# EAGLE schematic tfmsx (EAGLE 9.6.2)

## Sheet 1 of 2
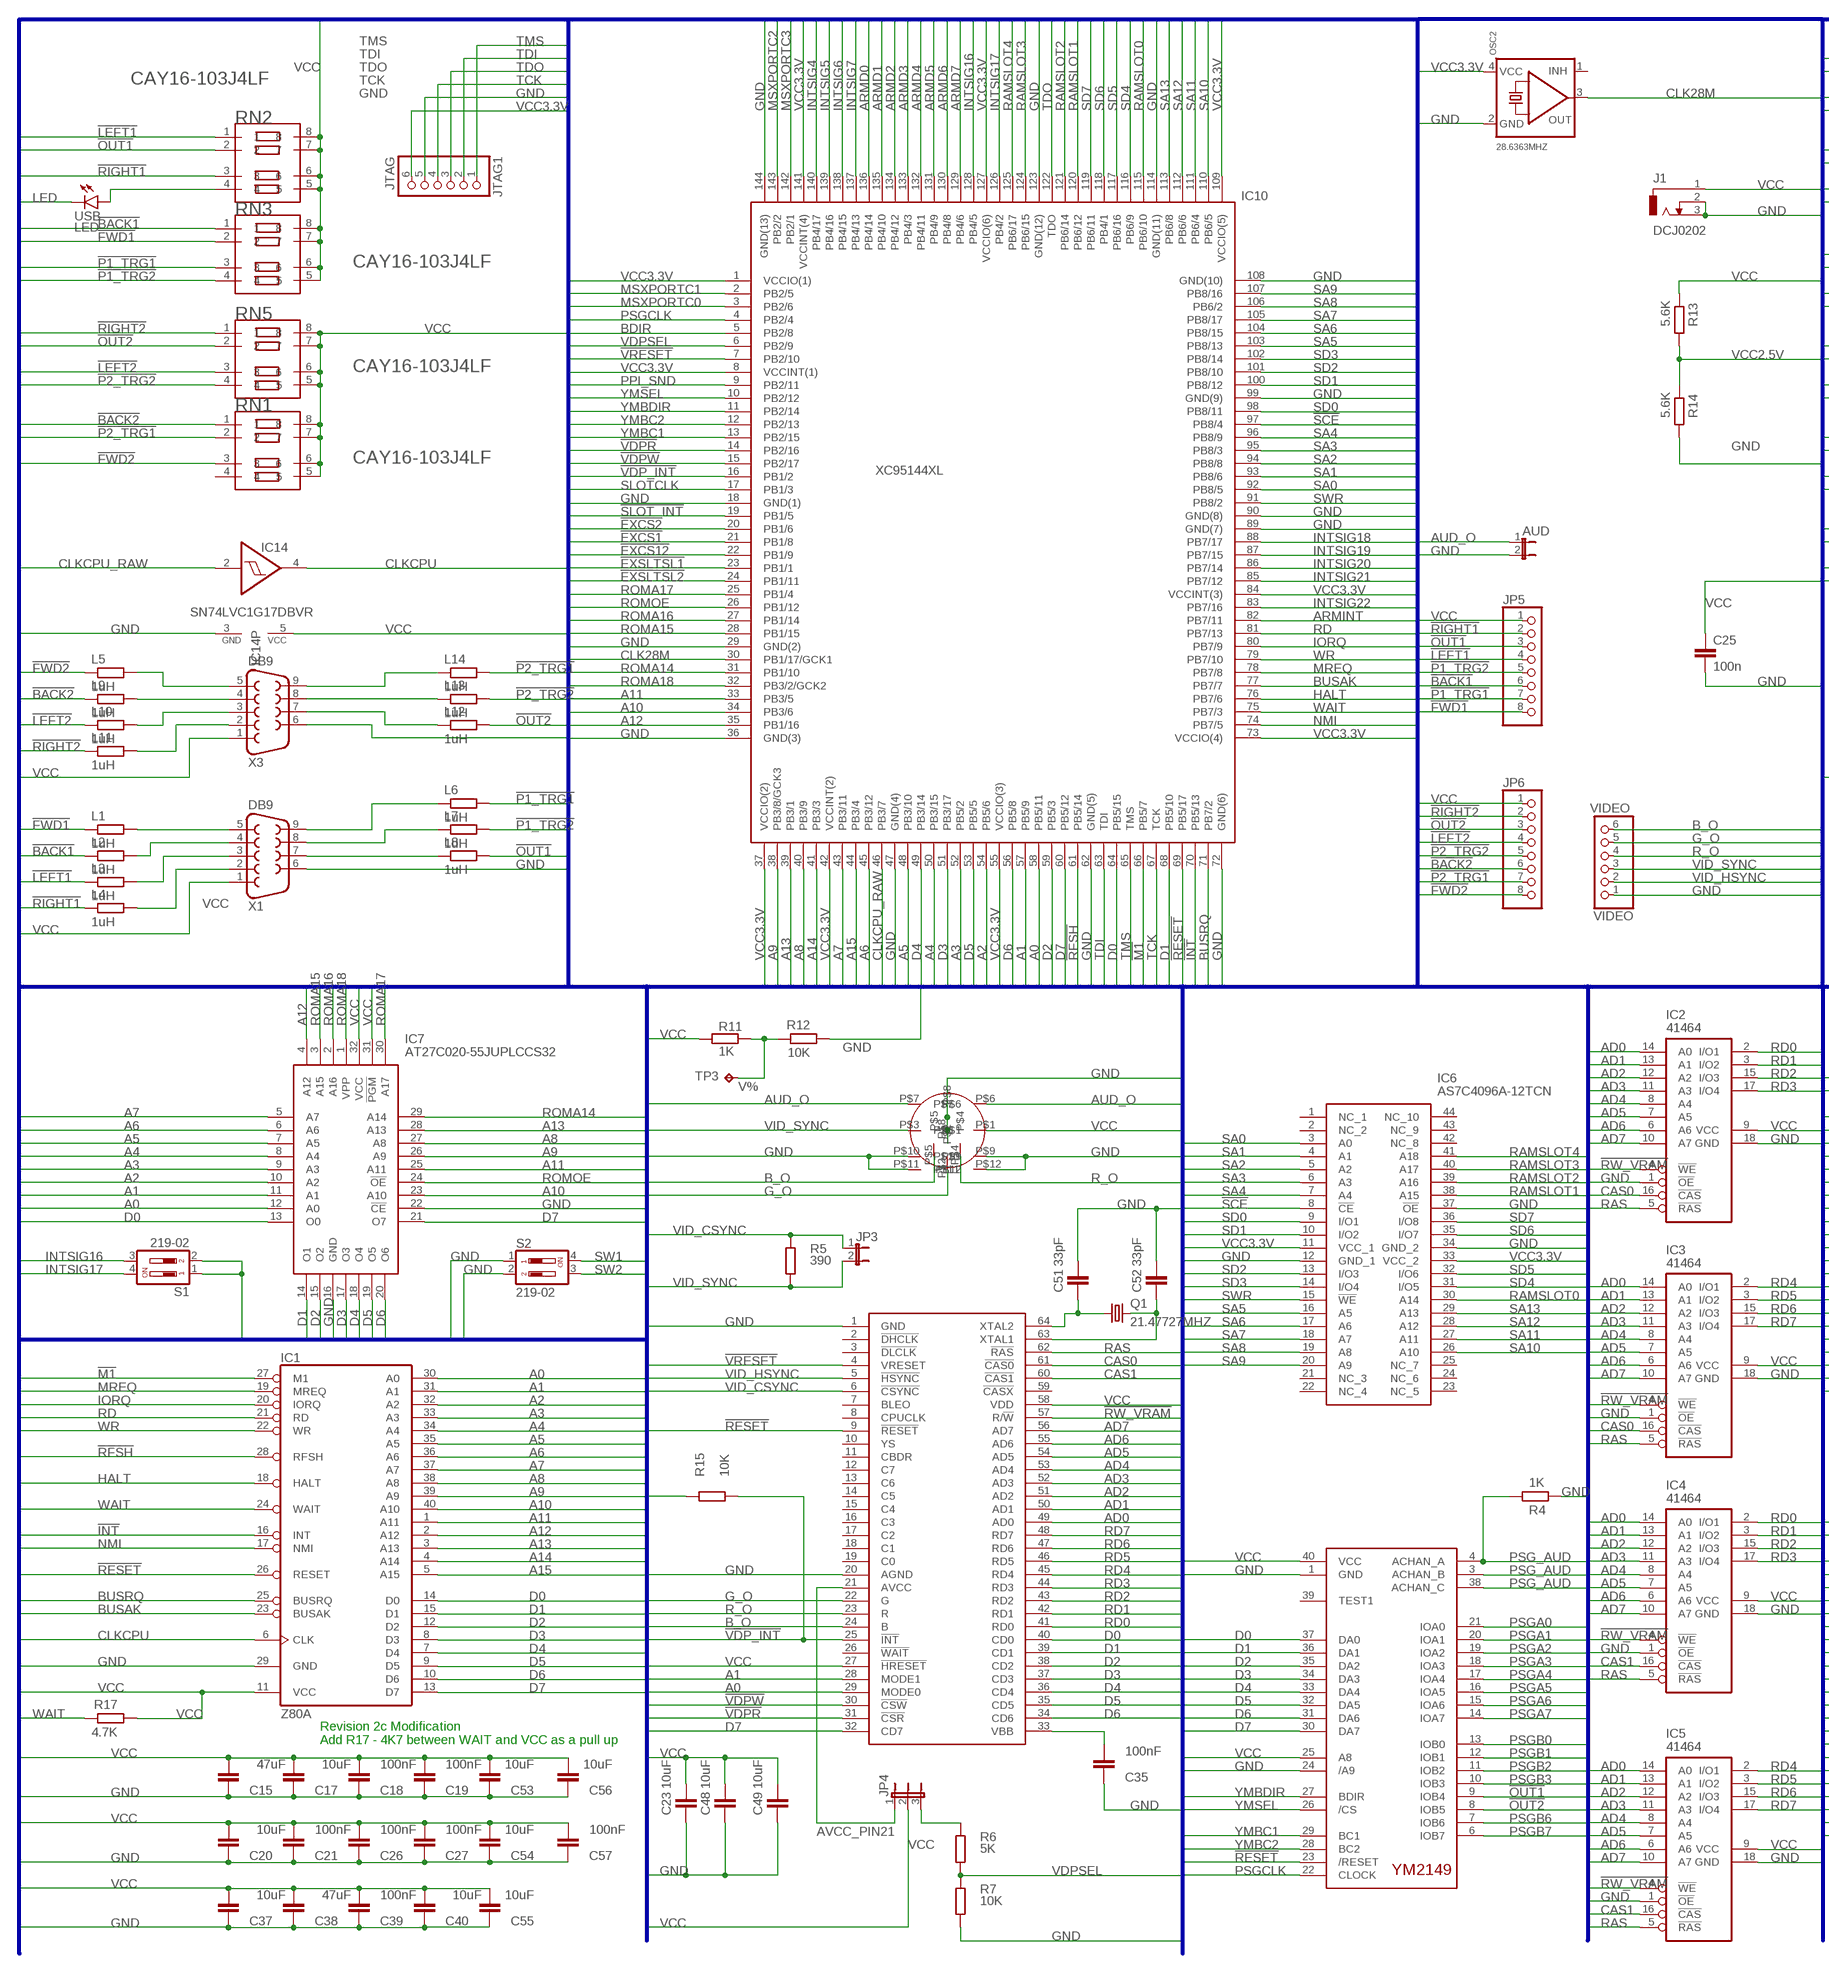
[diagram p0: schematic, sheet 1, part 1 of 2]
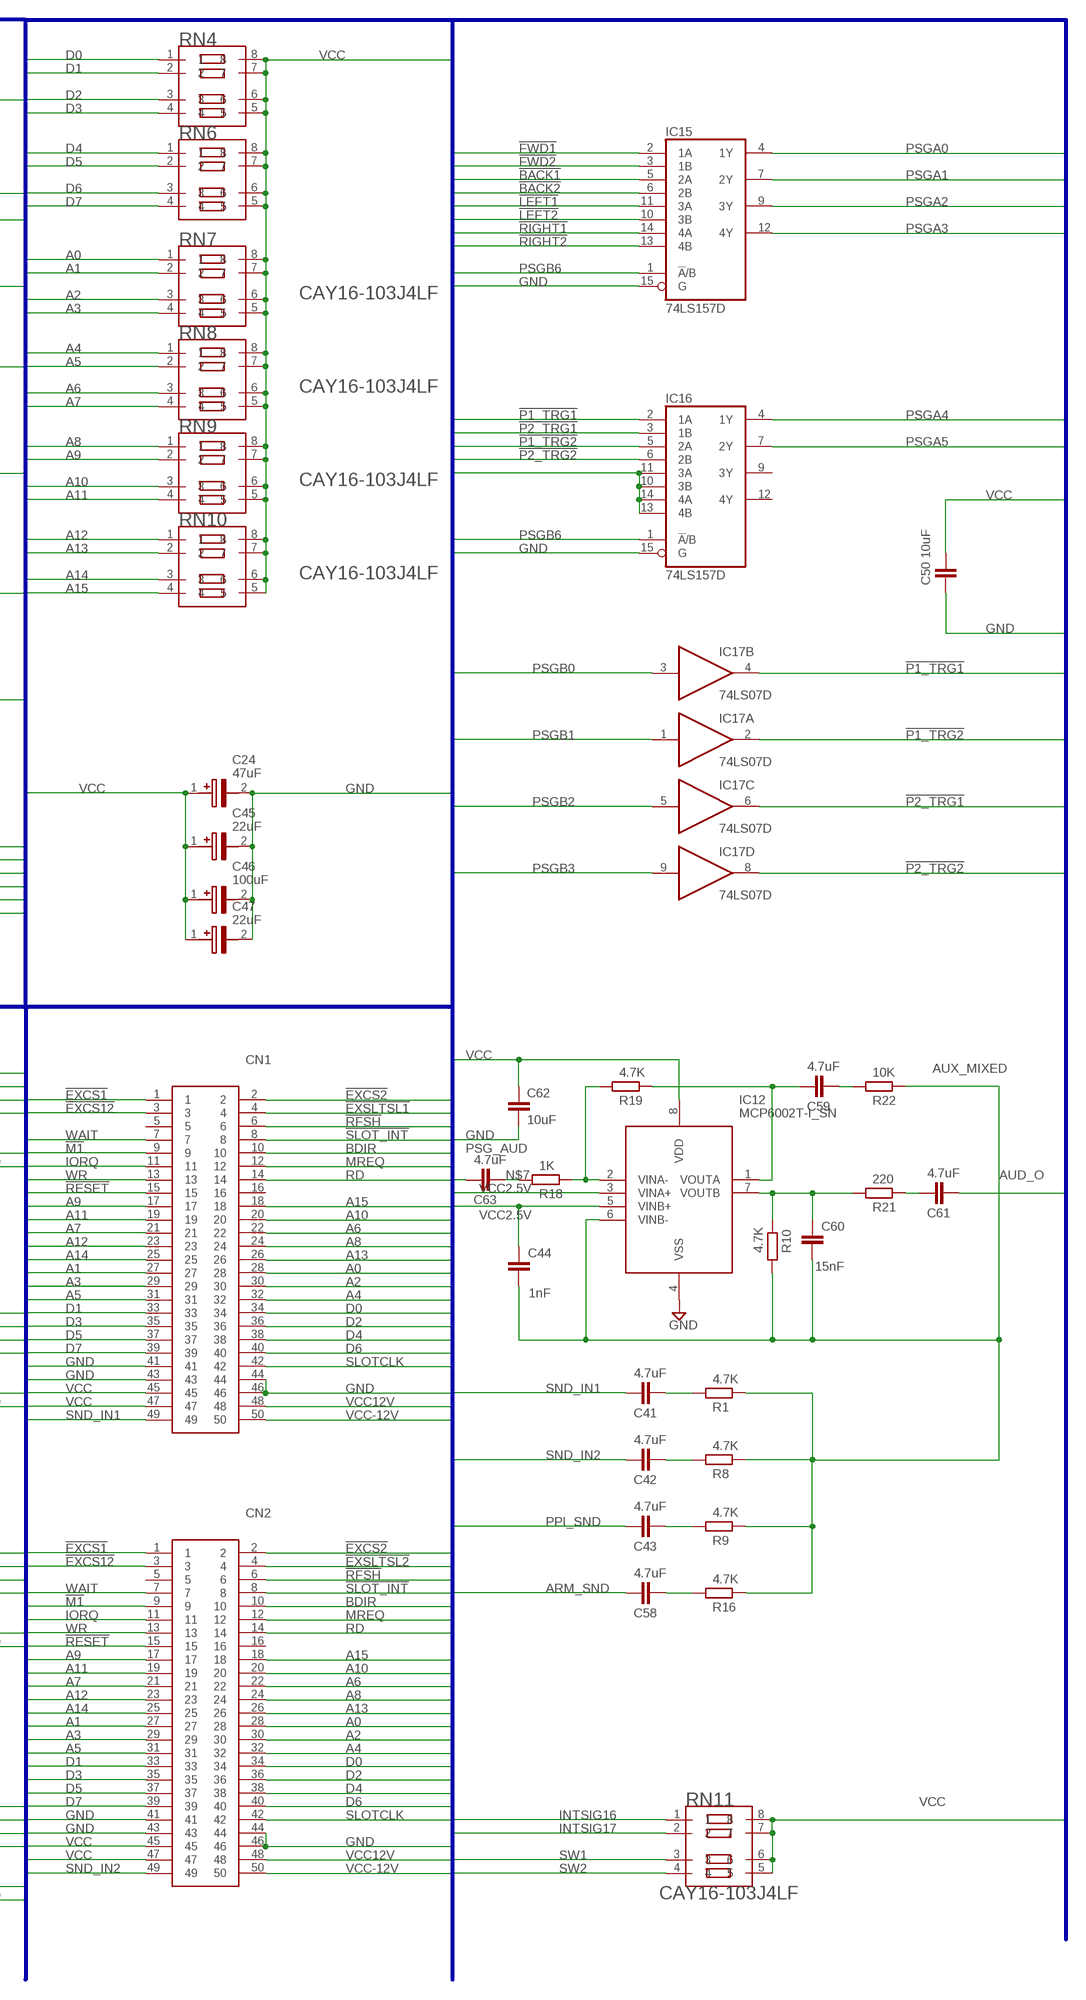
[diagram p1: schematic, sheet 1, part 2 of 2]

### Parts
AUD  JUMPER-2PTH  [1X02]
C15  47uF  C-EUC1206  [C1206]
C17  10uF  C-EUC1206  [C1206]
C18  100nF  C-EUC1206  [C1206]
C19  100nF  C-EUC1206  [C1206]
C20  10uF  C-EUC1206  [C1206]
C21  100nF  C-EUC1206  [C1206]
C23  10uF  C-EUC1206  [C1206]
C24  47uF  EEEHA1C100R  [CAPAE430X550N]
C25  100n  C-EUC0603  [C0603]
C26  100nF  C-EUC1206  [C1206]
C27  100nF  C-EUC1206  [C1206]
C35  100nF  C-EUC1206  [C1206]
C37  10uF  C-EUC1206  [C1206]
C38  47uF  C-EUC1206  [C1206]
C39  100nF  C-EUC1206  [C1206]
C40  10uF  C-EUC1206  [C1206]
C41  4.7uF  C-EUC0603  [C0603]
C42  4.7uF  C-EUC0603  [C0603]
C43  4.7uF  C-EUC0603  [C0603]
C44  1nF  C-EUC0603  [C0603]
C45  22uF  EEEHA1C100R  [CAPAE430X550N]
C46  100uF  EEEHA1C100R  [CAPAE430X550N]
C47  22uF  EEEHA1C100R  [CAPAE430X550N]
C48  10uF  C-EUC1206  [C1206]
C49  10uF  C-EUC1206  [C1206]
C50  10uF  C-EUC1206  [C1206]
C51  33pF  C-EUC0805  [C0805]
C52  33pF  C-EUC0805  [C0805]
C53  10uF  C-EUC1206  [C1206]
C54  10uF  C-EUC1206  [C1206]
C55  10uF  C-EUC1206  [C1206]
C56  10uF  C-EUC1206  [C1206]
C57  100nF  C-EUC1206  [C1206]
C58  4.7uF  C-EUC0603  [C0603]
C59  4.7uF  C-EUC0603  [C0603]
C60  15nF  C-EUC0603  [C0603]
C61  4.7uF  C-EUC0603  [C0603]
C62  10uF  C-EUC1206  [C1206]
C63  4.7uF  C-EUC0603  [C0603]
CN1  5530843-5  [55308435]
CN2  5530843-5  [55308435]
IC1  Z80A  Z80CPU  [DIL40]
IC2  41464  [DIL18]
IC3  41464  [DIL18]
IC4  41464  [DIL18]
IC5  41464  [DIL18]
IC6  AS7C4096A-12TCN  [SOP80P1181X120-44N]
IC7  AT27C020-55JUPLCCS32  [PLCC-S32]
IC9  VDP9958  [SOT274]
IC10  XC95144XL  SAMACSYS_PARTS_XC95144XL-10TQG144I  [SAMACSYS_PARTS_QFP50P2200X2200X160-144N]
IC12  MCP6002T-I_SN  [SOIC127P600X175-8N]
IC13  YM2149  [DIL40]
IC14  SN74LVC1G17DBVR  74LVC1G17DBV  [SOT23-5]
IC15  74LS157D  [SO16]
IC16  74LS157D  [SO16]
IC17  74LS07D  [SO14]
J1  DCJ0202  [DCJ0202]
JP3  JP1E  [JP1]
JP4  JP2E  [JP2]
JP5  HEADER-1X8ROUND  [1X08_ROUND]
JP6  HEADER-1X8ROUND  [1X08_ROUND]
JTAG1  JTAG  HEADER-1X6ROUND  [1X06_ROUND]
L1  1uH  R-EU_R1206  [R1206]
L2  1uH  R-EU_R1206  [R1206]
L3  1uH  R-EU_R1206  [R1206]
L4  1uH  R-EU_R1206  [R1206]
L5  1uH  R-EU_R1206  [R1206]
L6  1uH  R-EU_R1206  [R1206]
L7  1uH  R-EU_R1206  [R1206]
L8  1uH  R-EU_R1206  [R1206]
L9  1uH  R-EU_R1206  [R1206]
L10  1uH  R-EU_R1206  [R1206]
L11  1uH  R-EU_R1206  [R1206]
L12  1uH  R-EU_R1206  [R1206]
L13  1uH  R-EU_R1206  [R1206]
L14  1uH  R-EU_R1206  [R1206]
OSC2  28.6363MHZ  OSCILLATOR  [OSC_7X5MM]
Q1  21.47727MHZ  CRYSTALHC49S  [HC49/S]
R1  4.7K  R-EU_M0805  [M0805]
R4  1K  R-EU_M0805  [M0805]
R5  390  R-EU_M0805  [M0805]
R6  5K  R-EU_M0805  [M0805]
R7  10K  R-EU_M0805  [M0805]
R8  4.7K  R-EU_M0805  [M0805]
R9  4.7K  R-EU_M0805  [M0805]
R10  4.7K  R-EU_M0805  [M0805]
R11  1K  R-EU_M0805  [M0805]
R12  10K  R-EU_M0805  [M0805]
R13  5.6K  R-EU_M0805  [M0805]
R14  5.6K  R-EU_M0805  [M0805]
R15  10K  R-EU_M0805  [M0805]
R16  4.7K  R-EU_M0805  [M0805]
R17  4.7K  R-EU_M0805  [M0805]
R18  1K  R-EU_M0805  [M0805]
R19  4.7K  R-EU_M0805  [M0805]
R21  220  R-EU_M0805  [M0805]
R22  10K  R-EU_M0805  [M0805]
RN1  CAY16-103J4LF  [RESCAXE80P320X160-8N]
RN2  CAY16-103J4LF  [RESCAXE80P320X160-8N]
RN3  CAY16-103J4LF  [RESCAXE80P320X160-8N]
RN4  CAY16-103J4LF  [RESCAXE80P320X160-8N]
RN5  CAY16-103J4LF  [RESCAXE80P320X160-8N]
RN6  CAY16-103J4LF  [RESCAXE80P320X160-8N]
RN7  CAY16-103J4LF  [RESCAXE80P320X160-8N]
RN8  CAY16-103J4LF  [RESCAXE80P320X160-8N]
RN9  CAY16-103J4LF  [RESCAXE80P320X160-8N]
RN10  CAY16-103J4LF  [RESCAXE80P320X160-8N]
RN11  CAY16-103J4LF  [RESCAXE80P320X160-8N]
S1  219-02  [CTS-219-02]
S2  219-02  [CTS-219-02]
TP3  TPB1,27  [B1,27]
U$3  DIN45326  [838_DIN8]
USB  LED  LEDSML0805  [SML0805]
VIDEO  VIDEO  HEADER-1X6ROUND  [1X06_ROUND]
X1  DB9  F09HP  [F09HP]
X3  DB9  F09HP  [F09HP]

### Nets
!BACK1: IC15.5(2A) JP5.6 L2.1 RN3.1 ; also sheet 2
!BACK1_B: L2.2 X1.4
!BACK2: IC15.6(2B) JP6.6 L9.1 RN1.1
!EXCS1: CN1.1 CN2.1 IC10.21(PB1/8)
!EXCS2: CN1.2 CN2.2 IC10.20(PB1/6)
!EXCS12: CN1.3 CN2.3 IC10.22(PB1/9)
!EXSLTSL1: CN1.4 IC10.23(PB1/1)
!EXSLTSL2: CN2.4 IC10.24(PB1/11)
!FWD1: IC15.2(1A) JP5.8 L1.1 RN3.2 ; also sheet 2
!FWD1_B: L1.2 X1.5
!FWD2: IC15.3(1B) JP6.8 L5.1 RN1.3
!INT: IC1.16(INT) IC10.70(PB5/13)
!LEFT1: IC15.11(3A) JP5.4 L3.1 RN2.1 ; also sheet 2
!LEFT1_B: L3.2 X1.3
!LEFT2: IC15.10(3B) JP6.4 L10.1 RN5.3
!M1: CN1.9 CN2.9 IC1.27(M1) IC10.66(PB5/7)
!OUT1: IC13.9(IOB4) JP5.3 L8.2 RN2.2 ; also sheet 2
!OUT2: IC13.8(IOB5) JP6.3 L12.2 RN5.2
!P1_TRG1: IC16.2(1A) IC17.4(B:O) JP5.7 L6.2 RN3.3 ; also sheet 2
!P1_TRG2: IC16.5(2A) IC17.2(A:O) JP5.5 L7.2 RN3.4 ; also sheet 2
!P2_TRG1: IC16.3(1B) IC17.6(C:O) JP6.7 L14.2 RN1.2
!P2_TRG2: IC16.6(2B) IC17.8(D:O) JP6.5 L13.2 RN5.4
!RESET: CN1.15 CN2.15 IC1.26(RESET) IC9.9(!RESET) IC10.69(PB5/17) IC13.23(/RESET)
!RFSH: CN1.6 CN2.6 IC1.28(RFSH) IC10.61(PB5/14)
!RIGHT1: IC15.14(4A) JP5.2 L4.1 RN2.3 ; also sheet 2
!RIGHT1_B: L4.2 X1.2
!RIGHT2: IC15.13(4B) JP6.2 L11.1 RN5.1
!RW_VRAM: IC2.4(!WE) IC3.4(!WE) IC4.4(!WE) IC5.4(!WE) IC9.57(R/!W)
!SCE: IC6.8(!CE) IC10.97(PB8/4)
!SLOT_INT: CN1.8 CN2.8 IC10.19(PB1/5)
!VDP_INT: IC9.25(!INT) IC10.16(PB1/2) R15.1
!VDPR: IC9.31(!CSR) IC10.14(PB2/16)
!VDPW: IC9.30(!CSW) IC10.15(PB2/17)
!VRESET: IC9.4(VRESET) IC10.7(PB2/10)
A0: CN1.28 CN2.28 IC1.30(A0) IC7.12(A0) IC9.29(MODE0) IC10.58(PB5/11) RN7.1
A1: CN1.27 CN2.27 IC1.31(A1) IC7.11(A1) IC9.28(MODE1) IC10.57(PB5/9) RN7.2
A2: CN1.30 CN2.30 IC1.32(A2) IC7.10(A2) IC10.54(PB5/6) RN7.3
A3: CN1.29 CN2.29 IC1.33(A3) IC7.9(A3) IC10.52(PB5/2) RN7.4
A4: CN1.32 CN2.32 IC1.34(A4) IC7.8(A4) IC10.50(PB3/15) RN8.1
A5: CN1.31 CN2.31 IC1.35(A5) IC7.7(A5) IC10.48(PB3/10) RN8.2
A6: CN1.22 CN2.22 IC1.36(A6) IC7.6(A6) IC10.45(PB3/12) RN8.3
A7: CN1.21 CN2.21 IC1.37(A7) IC7.5(A7) IC10.43(PB3/11) RN8.4
A8: CN1.24 CN2.24 IC1.38(A8) IC7.27(A8) IC10.40(PB3/9) RN9.1
A9: CN1.17 CN2.17 IC1.39(A9) IC7.26(A9) IC10.38(PB3/8/GCK3) RN9.2
A10: CN1.20 CN2.20 IC1.40(A10) IC7.23(A10) IC10.34(PB3/6) RN9.3
A11: CN1.19 CN2.19 IC1.1(A11) IC7.25(A11) IC10.33(PB3/5) RN9.4
A12: CN1.23 CN2.23 IC1.2(A12) IC7.4(A12) IC10.35(PB1/16) RN10.1
A13: CN1.26 CN2.26 IC1.3(A13) IC7.28(A13) IC10.39(PB3/1) RN10.2
A14: CN1.25 CN2.25 IC1.4(A14) IC10.41(PB3/3) RN10.3
A15: CN1.18 CN2.18 IC1.5(A15) IC10.44(PB3/4) RN10.4
AD0: IC2.14(A0) IC3.14(A0) IC4.14(A0) IC5.14(A0) IC9.49(AD0)
AD1: IC2.13(A1) IC3.13(A1) IC4.13(A1) IC5.13(A1) IC9.50(AD1)
AD2: IC2.12(A2) IC3.12(A2) IC4.12(A2) IC5.12(A2) IC9.51(AD2)
AD3: IC2.11(A3) IC3.11(A3) IC4.11(A3) IC5.11(A3) IC9.52(AD3)
AD4: IC2.8(A4) IC3.8(A4) IC4.8(A4) IC5.8(A4) IC9.53(AD4)
AD5: IC2.7(A5) IC3.7(A5) IC4.7(A5) IC5.7(A5) IC9.54(AD5)
AD6: IC2.6(A6) IC3.6(A6) IC4.6(A6) IC5.6(A6) IC9.55(AD6)
AD7: IC2.10(A7) IC3.10(A7) IC4.10(A7) IC5.10(A7) IC9.56(AD7)
ARM_SND: C58.1 ; also sheet 2
ARMD0: IC10.136(PB4/14) ; also sheet 2
ARMD1: IC10.135(PB4/10) ; also sheet 2
ARMD2: IC10.134(PB4/12) ; also sheet 2
ARMD3: IC10.133(PB4/3) ; also sheet 2
ARMD4: IC10.132(PB4/11) ; also sheet 2
ARMD5: IC10.131(PB4/9) ; also sheet 2
ARMD6: IC10.130(PB4/8) ; also sheet 2
ARMD7: IC10.129(PB4/6) ; also sheet 2
ARMINT: IC10.82(PB7/11) ; also sheet 2
AUD_O: AUD.1 C61.2 U$3.P$6 U$3.P$7
AUX_MIXED: C44.1 C60.1 IC12.6(VINB-) R1.1 R8.1 R9.1 R10.2 R16.1 R22.1
AVCC_PIN21: IC9.21(AVCC) JP4.1
B_O: IC9.24(B) U$3.P$5 VIDEO.6
BDIR: CN1.10 CN2.10 IC10.5(PB2/8)
BUSAK: IC1.23(BUSAK) IC10.77(PB7/7)
BUSRQ: IC1.25(BUSRQ) IC10.71(PB7/2)
CAS0: IC2.16(!CAS) IC3.16(!CAS) IC9.61(!CAS0)
CAS1: IC4.16(!CAS) IC5.16(!CAS) IC9.60(!CAS1)
CLK28M: IC10.30(PB1/17/GCK1) OSC2.3(OUT)
CLKCPU: IC1.6(CLK) IC14.4(O)
CLKCPU_RAW: IC10.46(PB3/7) IC14.2(I)
D0: CN1.34 CN2.34 IC1.14(D0) IC7.13(O0) IC9.40(CD0) IC10.64(PB5/15) IC13.37(DA0) RN4.1
D1: CN1.33 CN2.33 IC1.15(D1) IC7.14(O1) IC9.39(CD1) IC10.68(PB5/10) IC13.36(DA1) RN4.2
D2: CN1.36 CN2.36 IC1.12(D2) IC7.15(O2) IC9.38(CD2) IC10.59(PB5/3) IC13.35(DA2) RN4.3
D3: CN1.35 CN2.35 IC1.8(D3) IC7.17(O3) IC9.37(CD3) IC10.51(PB3/17) IC13.34(DA3) RN4.4
D4: CN1.38 CN2.38 IC1.7(D4) IC7.18(O4) IC9.36(CD4) IC10.49(PB3/14) IC13.33(DA4) RN6.1
D5: CN1.37 CN2.37 IC1.9(D5) IC7.19(O5) IC9.35(CD5) IC10.53(PB5/5) IC13.32(DA5) RN6.2
D6: CN1.40 CN2.40 IC1.10(D6) IC7.20(O6) IC9.34(CD6) IC10.56(PB5/8) IC13.31(DA6) RN6.3
D7: CN1.39 CN2.39 IC1.13(D7) IC7.21(O7) IC9.32(CD7) IC10.60(PB5/12) IC13.30(DA7) RN6.4
G_O: IC9.22(G) U$3.P$2 VIDEO.5
GND: AUD.2 C15.1 C17.1 C18.1 C19.1 C20.1 C21.1 C23.1 C24.2(-) C25.2 C26.1 C27.1 C35.1 C37.1 C38.1 C39.1 C40.1 C45.2(-) C46.2(-) C47.2(-) C48.1 C49.1 C50.1 C51.2 C52.2 C53.1 C54.1 C55.1 C56.1 C57.1 C62.2 CN1.41 CN1.43 CN1.44 CN1.46 CN2.41 CN2.43 CN2.44 CN2.46 IC1.29(GND) IC2.1(!OE) IC2.18(GND) IC3.1(!OE) IC3.18(GND) IC4.1(!OE) IC4.18(GND) IC5.1(!OE) IC5.18(GND) IC6.12(GND_1) IC6.34(GND_2) IC6.37(!OE) IC7.16(GND) IC7.22(!CE) IC9.1(GND) IC9.20(AGND) IC10.18(GND(1)) IC10.29(GND(2)) IC10.36(GND(3)) IC10.47(GND(4)) IC10.62(GND(5)) IC10.72(GND(6)) IC10.89(GND(7)) IC10.90(GND(8)) IC10.99(GND(9)) IC10.108(GND(10)) IC10.114(GND(11)) IC10.123(GND(12)) IC10.144(GND(13)) IC12.4(VSS) IC13.1(GND) IC13.24(/A9) IC14.3(GND) IC15.15(G) IC16.10(3B) IC16.11(3A) IC16.13(4B) IC16.14(4A) IC16.15(G) J1.2 J1.3 JTAG1.5 OSC2.2(GND) R4.1 R7.1 R12.1 R14.2 S1.1 S1.2 S2.1 S2.2 U$3.P$8 U$3.P$9 U$3.P$10 U$3.P$11 U$3.P$12 VIDEO.1 X1.6 X3.6 ; also sheet 2
HALT: IC1.18(HALT) IC10.76(PB7/6)
INTSIG4: IC10.140(PB4/17) ; also sheet 2
INTSIG5: IC10.139(PB4/16) ; also sheet 2
INTSIG6: IC10.138(PB4/15) ; also sheet 2
INTSIG7: IC10.137(PB4/13) ; also sheet 2
INTSIG16: IC10.128(PB4/5) RN11.1 S1.3 ; also sheet 2
INTSIG17: IC10.126(PB4/2) RN11.2 S1.4 ; also sheet 2
INTSIG18: IC10.88(PB7/17) ; also sheet 2
INTSIG19: IC10.87(PB7/15) ; also sheet 2
INTSIG20: IC10.86(PB7/14) ; also sheet 2
INTSIG21: IC10.85(PB7/12) ; also sheet 2
INTSIG22: IC10.83(PB7/16) ; also sheet 2
IORQ: CN1.11 CN2.11 IC1.20(IORQ) IC10.80(PB7/9)
LED: USB.C ; also sheet 2
MREQ: CN1.12 CN2.12 IC1.19(MREQ) IC10.78(PB7/8)
MSXPORTC0: IC10.3(PB2/6) ; also sheet 2
MSXPORTC1: IC10.2(PB2/5) ; also sheet 2
MSXPORTC2: IC10.143(PB2/2) ; also sheet 2
MSXPORTC3: IC10.142(PB2/1) ; also sheet 2
N$1: C51.1 IC9.64(XTAL2) Q1.1
N$2: C52.1 IC9.63(XTAL1) Q1.2
N$3: C35.2 IC9.33(VBB)
N$4: L8.1 X1.7
N$5: L7.1 X1.8
N$6: L6.1 X1.9
N$7: C63.2 R18.2
N$11: L9.2 X3.4
N$12: L10.2 X3.3
N$13: L11.2 X3.2
N$14: L5.2 X3.5
N$15: L12.1 X3.7
N$16: L13.1 X3.8
N$17: L14.1 X3.9
N$19: RN2.4 USB.A
N$22: C41.2 R1.2
N$23: C42.2 R8.2
N$24: C43.2 R9.2
N$25: C58.2 R16.2
N$27: JP4.3 R6.2
N$31: IC12.2(VINA-) R18.1 R19.2
N$32: C59.1 IC12.1(VOUTA) R19.1
N$34: C59.2 R22.2
N$36: C60.2 IC12.7(VOUTB) R10.1 R21.2
N$37: C61.1 R21.1
NMI: IC1.17(NMI) IC10.74(PB7/5)
PPI_SND: C43.1 IC10.9(PB2/11)
PSG_AUD: C63.1 IC13.3(ACHAN_B) IC13.4(ACHAN_A) IC13.38(ACHAN_C) R4.2
PSGA0: IC13.21(IOA0) IC15.4(1Y)
PSGA1: IC13.20(IOA1) IC15.7(2Y)
PSGA2: IC13.19(IOA2) IC15.9(3Y)
PSGA3: IC13.18(IOA3) IC15.12(4Y)
PSGA4: IC13.17(IOA4) IC16.4(1Y)
PSGA5: IC13.16(IOA5) IC16.7(2Y)
PSGA6: IC13.15(IOA6)
PSGA7: IC13.14(IOA7)
PSGB0: IC13.13(IOB0) IC17.3(B:I)
PSGB1: IC13.12(IOB1) IC17.1(A:I)
PSGB2: IC13.11(IOB2) IC17.5(C:I)
PSGB3: IC13.10(IOB3) IC17.9(D:I)
PSGB6: IC13.7(IOB6) IC15.1(!A!/B) IC16.1(!A!/B)
PSGB7: IC13.6(IOB7)
PSGCLK: IC10.4(PB2/4) IC13.22(CLOCK)
R_O: IC9.23(R) U$3.P$4 VIDEO.4
RAMSLOT0: IC6.30(A14) IC10.115(PB6/10)
RAMSLOT1: IC6.38(A15) IC10.120(PB6/12)
RAMSLOT2: IC6.39(A16) IC10.121(PB6/14)
RAMSLOT3: IC6.40(A17) IC10.124(PB6/15)
RAMSLOT4: IC6.41(A18) IC10.125(PB6/17)
RAS: IC2.5(!RAS) IC3.5(!RAS) IC4.5(!RAS) IC5.5(!RAS) IC9.62(!RAS)
RD: CN1.14 CN2.14 IC1.21(RD) IC10.81(PB7/13)
RD0: IC2.2(I/O1) IC4.2(I/O1) IC9.41(RD0)
RD1: IC2.3(I/O2) IC4.3(I/O2) IC9.42(RD1)
RD2: IC2.15(I/O3) IC4.15(I/O3) IC9.43(RD2)
RD3: IC2.17(I/O4) IC4.17(I/O4) IC9.44(RD3)
RD4: IC3.2(I/O1) IC5.2(I/O1) IC9.45(RD4)
RD5: IC3.3(I/O2) IC5.3(I/O2) IC9.46(RD5)
RD6: IC3.15(I/O3) IC5.15(I/O3) IC9.47(RD6)
RD7: IC3.17(I/O4) IC5.17(I/O4) IC9.48(RD7)
ROMA14: IC7.29(A14) IC10.31(PB1/10)
ROMA15: IC7.3(A15) IC10.28(PB1/15)
ROMA16: IC7.2(A16) IC10.27(PB1/14)
ROMA17: IC7.30(A17) IC10.25(PB1/4)
ROMA18: IC7.1(VPP) IC10.32(PB3/2/GCK2)
ROMOE: IC7.24(!OE) IC10.26(PB1/12)
SA0: IC6.3(A0) IC10.92(PB8/5)
SA1: IC6.4(A1) IC10.93(PB8/6)
SA2: IC6.5(A2) IC10.94(PB8/8)
SA3: IC6.6(A3) IC10.95(PB8/3)
SA4: IC6.7(A4) IC10.96(PB8/9)
SA5: IC6.16(A5) IC10.103(PB8/13)
SA6: IC6.17(A6) IC10.104(PB8/15)
SA7: IC6.18(A7) IC10.105(PB8/17)
SA8: IC6.19(A8) IC10.106(PB6/2)
SA9: IC6.20(A9) IC10.107(PB8/16)
SA10: IC6.26(A10) IC10.110(PB6/5)
SA11: IC6.27(A11) IC10.111(PB6/4)
SA12: IC6.28(A12) IC10.112(PB6/6)
SA13: IC6.29(A13) IC10.113(PB6/8)
SD0: IC6.9(I/O1) IC10.98(PB8/11)
SD1: IC6.10(I/O2) IC10.100(PB8/12)
SD2: IC6.13(I/O3) IC10.101(PB8/10)
SD3: IC6.14(I/O4) IC10.102(PB8/14)
SD4: IC6.31(I/O5) IC10.116(PB6/9)
SD5: IC6.32(I/O6) IC10.117(PB6/16)
SD6: IC6.35(I/O7) IC10.118(PB4/1)
SD7: IC6.36(I/O8) IC10.119(PB6/11)
SLOTCLK: CN1.42 CN2.42 IC10.17(PB1/3)
SND_IN1: C41.1 CN1.49
SND_IN2: C42.1 CN2.49
SW1: RN11.3 S2.4 ; also sheet 2
SW2: RN11.4 S2.3 ; also sheet 2
SWR: IC6.15(!WE) IC10.91(PB8/2)
TCK: IC10.67(TCK) JTAG1.4
TDI: IC10.63(TDI) JTAG1.2
TDO: IC10.122(TDO) JTAG1.3
TMS: IC10.65(TMS) JTAG1.1
V%: R11.1 R12.2 TP3.TP
VCC: C15.2 C17.2 C18.2 C19.2 C20.2 C21.2 C23.2 C24.1(+) C25.1 C26.2 C27.2 C37.2 C38.2 C39.2 C40.2 C45.1(+) C46.1(+) C47.1(+) C48.2 C49.2 C50.2 C53.2 C54.2 C55.2 C56.2 C57.2 C62.1 CN1.45 CN1.47 CN2.45 CN2.47 IC1.11(VCC) IC2.9(VCC) IC3.9(VCC) IC4.9(VCC) IC5.9(VCC) IC7.31(!PGM) IC7.32(VCC) IC9.27(!HRESET) IC9.58(VDD) IC12.8(VDD) IC13.25(A8) IC13.40(VCC) IC14.5(VCC) J1.1 JP4.2 JP5.1 JP6.1 R11.2 R13.1 R15.2 R17.2 RN1.5 RN1.6 RN1.7 RN1.8 RN2.5 RN2.6 RN2.7 RN2.8 RN3.5 RN3.6 RN3.7 RN3.8 RN4.5 RN4.6 RN4.7 RN4.8 RN5.5 RN5.6 RN5.7 RN5.8 RN6.5 RN6.6 RN6.7 RN6.8 RN7.5 RN7.6 RN7.7 RN7.8 RN8.5 RN8.6 RN8.7 RN8.8 RN9.5 RN9.6 RN9.7 RN9.8 RN10.5 RN10.6 RN10.7 RN10.8 RN11.5 RN11.6 RN11.7 RN11.8 U$3.P$1 X1.1 X3.1 ; also sheet 2
VCC2.5V: C44.2 IC12.3(VINA+) IC12.5(VINB+) R13.2 R14.1
VCC3.3V: IC6.11(VCC_1) IC6.33(VCC_2) IC10.1(VCCIO(1)) IC10.8(VCCINT(1)) IC10.37(VCCIO(2)) IC10.42(VCCINT(2)) IC10.55(VCCIO(3)) IC10.73(VCCIO(4)) IC10.84(VCCINT(3)) IC10.109(VCCIO(5)) IC10.127(VCCIO(6)) IC10.141(VCCINT(4)) JTAG1.6 OSC2.4(VCC) ; also sheet 2
VCC12V: CN1.48 CN2.48
VCC-12V: CN1.50 CN2.50
VDPSEL: IC10.6(PB2/9) R6.1 R7.2
VID_CSYNC: IC9.6(!CSYNC) JP3.1 R5.2
VID_HSYNC: IC9.5(!HSYNC) VIDEO.2
VID_SYNC: JP3.2 R5.1 U$3.P$3 VIDEO.3
WAIT: CN1.7 CN2.7 IC1.24(WAIT) IC10.75(PB7/3) R17.1
WR: CN1.13 CN2.13 IC1.22(WR) IC10.79(PB7/10)
YMBC1: IC10.13(PB2/15) IC13.29(BC1)
YMBC2: IC10.12(PB2/13) IC13.28(BC2)
YMBDIR: IC10.11(PB2/14) IC13.27(BDIR)
YMSEL: IC10.10(PB2/12) IC13.26(/CS)
Unconnected: CN1.5 CN1.16 CN2.5 CN2.16 IC6.1(NC_1) IC6.2(NC_2) IC6.21(NC_3) IC6.22(NC_4) IC6.23(NC_5) IC6.24(NC_6) IC6.25(NC_7) IC6.42(NC_8) IC6.43(NC_9) IC6.44(NC_10) IC9.2(!DHCLK) IC9.3(!DLCLK) IC9.7(BLEO) IC9.8(CPUCLK) IC9.10(YS) IC9.11(CBDR) IC9.12(C7) IC9.13(C6) IC9.14(C5) IC9.15(C4) IC9.16(C3) IC9.17(C2) IC9.18(C1) IC9.19(C0) IC9.26(!WAIT) IC9.59(!CASX) IC13.39(TEST1) IC16.9(3Y) IC16.12(4Y) IC17.10(E:O) IC17.11(E:I) IC17.12(F:O) IC17.13(F:I) OSC2.1(INH) RN1.4

### Buses
A[0..15],AD[0..7],ARMD[0..7],ARM_D[0..7],ARMINT,ARM_SND,AUD_O,!BACK[1..2],BDIR,B_O,BUSAK,BUSRQ,CAS[0..3],CD[0..7],CLK28M,CLKCPU,CLKCPU_CLEAN,CLKCPU_RAW,D[0..7],!EXCS[1..2],!EXCS12,!EXSLTSL[1..2],!FWD[1..2],GND,G_O,HALT,!INT,INTSIG[0..23],IORQ,LED,!LEFT[1..2],!M1,MREQ,MSXPORTB[0..7],MSXPORTC[0..7],NMI,O_AUD,!OUT[1..2],!P1_TRG[1..2],!P2_TRG[1..2],PPI_SND,PSGA[0..7],PSG_AUD,PSGB[0..7],PSG_CHAN[1..3],PSGCLK,RAMSLOT[0..4],RAS,RD,RD[0..7],!RESET,!RFSH,!RIGHT[1..2],R_O,ROMA[14..18],ROMCE,ROMOE,!RW_VRAM,SA[0..13],SCC_AUD,!SCE,SD[0..7],SLOTCLK,!SLOT_INT,SND_IN[1..2],SOUND_IN,SW[1..2],SWR,TCK,TDI,TDO,TMS,VCC,VCC2.5V,VCC3.3V,VCC-12V,VCC12V,!VDP_INT,!VDPR,VDPSEL,!VDPW,VID_CSYNC,VID_GND,VID_HSYNC,VID_SYNC,!VRESET,WAIT,WR,YMA8,!YMA9,YMBC[1..2],YMBDIR,YMSEL

### Notes on the sheet
- Revision 2c Modification 
  Add R17 - 4K7 between WAIT and VCC as a pull up

## Sheet 2 of 2
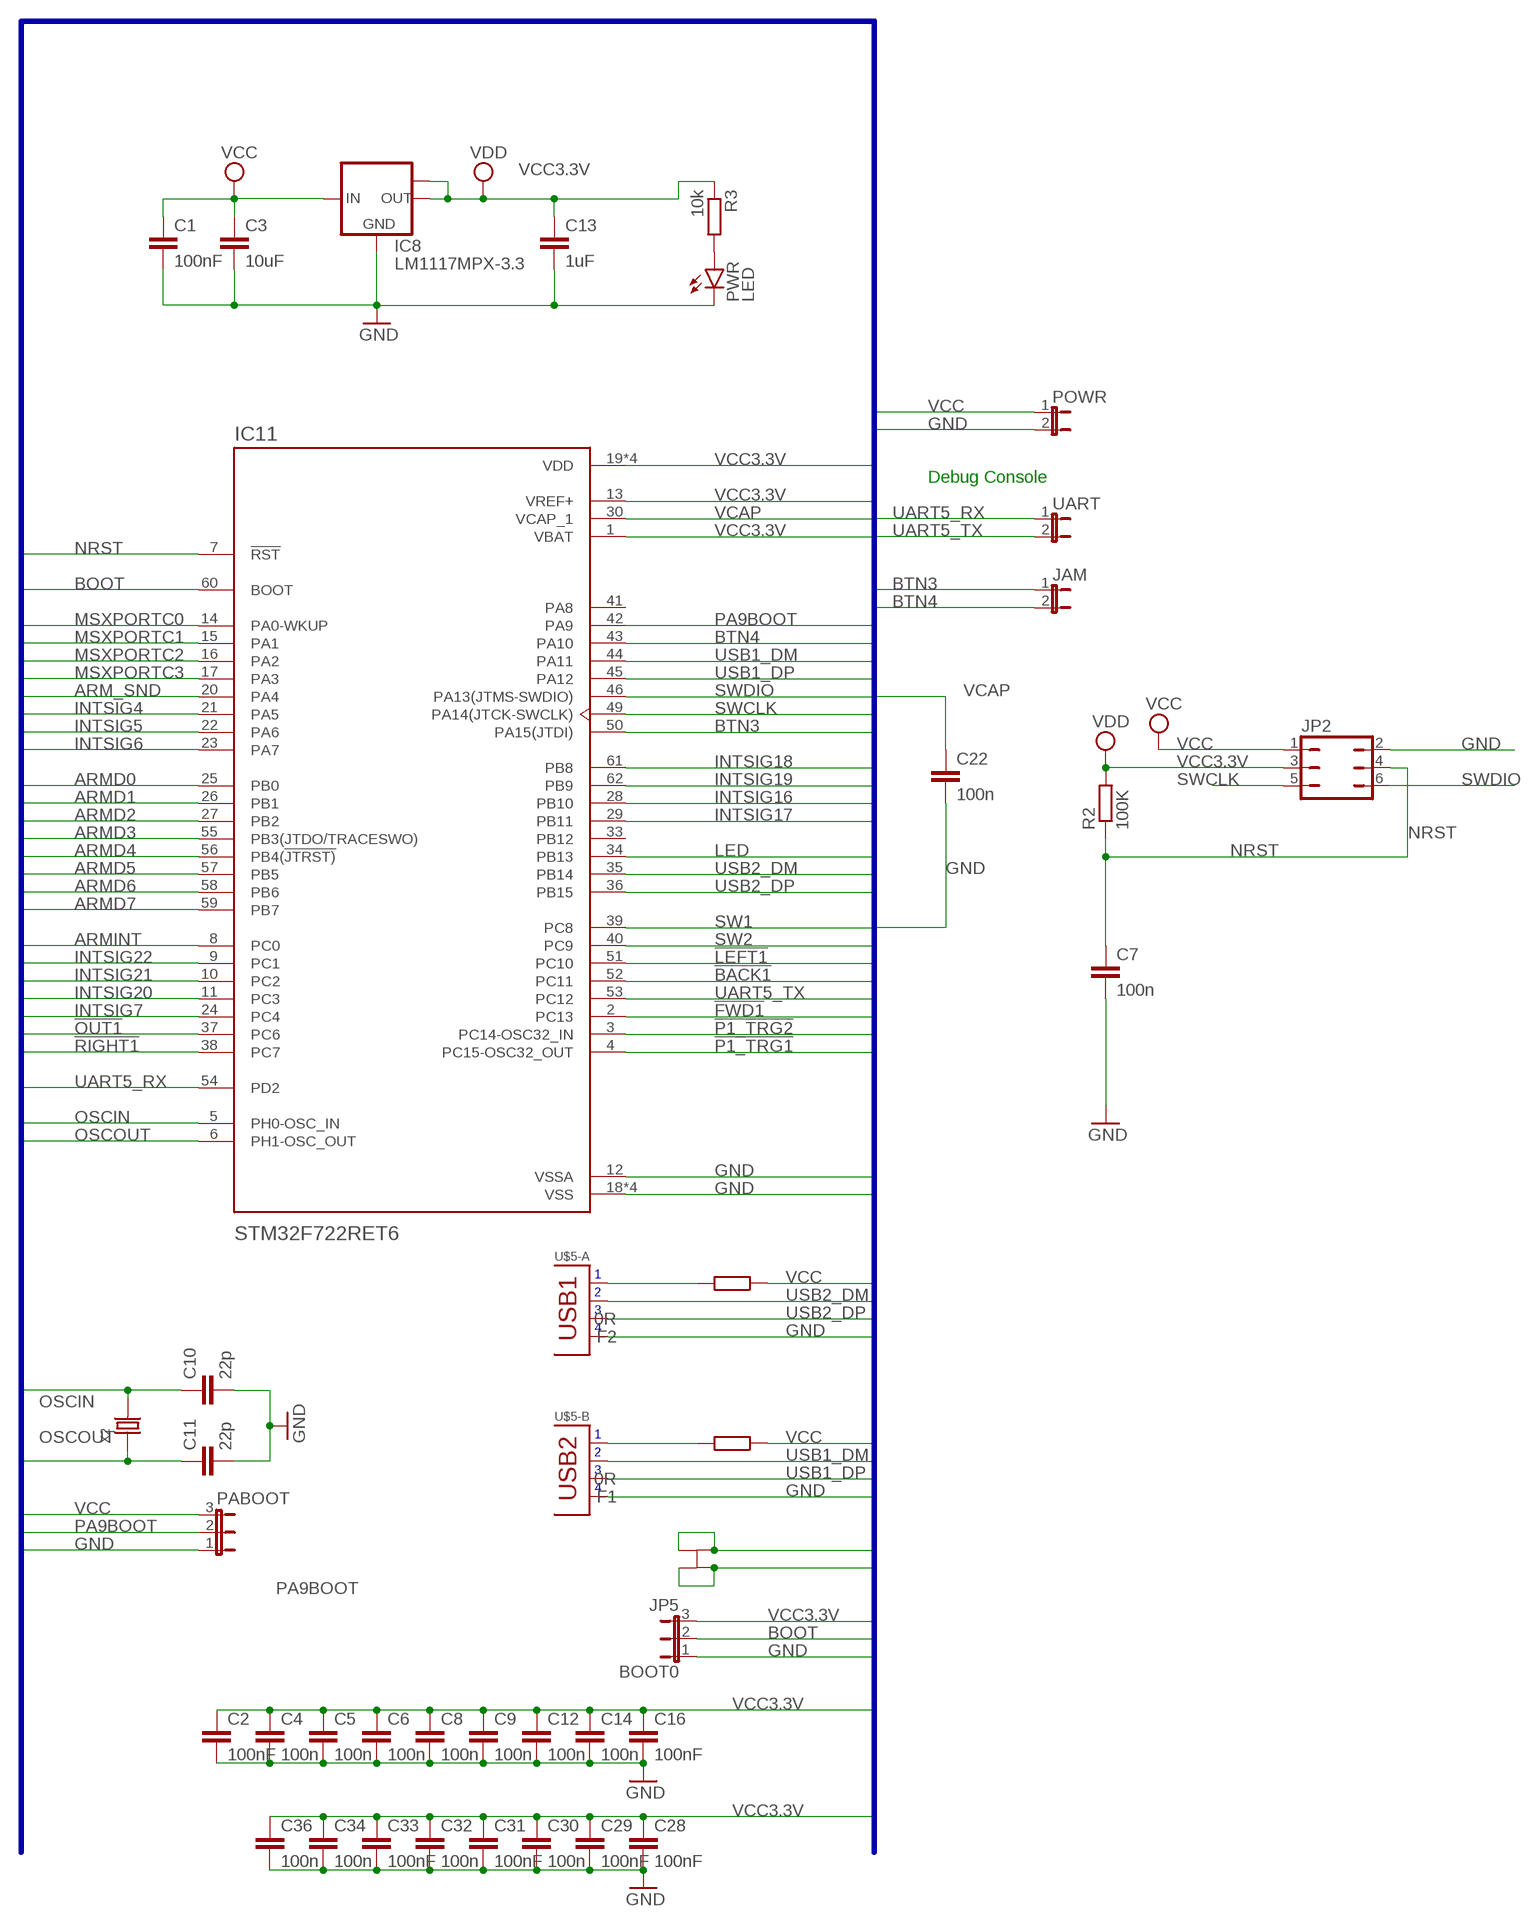
[diagram p2: schematic, sheet 2]

### Parts
BOOT0  JP5  JP2E  [JP2]
C1  100nF  C-EUC1206  [C1206]
C2  100nF  CC0603  [C0603]
C3  10uF  CC0603  [C0603]
C4  100n  CC0603  [C0603]
C5  100n  CC0603  [C0603]
C6  100n  C-EUC0603  [C0603]
C7  100n  CC0603  [C0603]
C8  100n  CC0603  [C0603]
C9  100n  CC0603  [C0603]
C10  22p  CC0603  [C0603]
C11  22p  CC0603  [C0603]
C12  100n  C-EUC0603  [C0603]
C13  1uF  C-EUC1206  [C1206]
C14  100n  CC0603  [C0603]
C16  100nF  CC0603  [C0603]
C22  100n  C-EUC0805  [C0805]
C28  100nF  CC0603  [C0603]
C29  100nF  CC0603  [C0603]
C30  100n  C-EUC0603  [C0603]
C31  100nF  CC0603  [C0603]
C32  100n  CC0603  [C0603]
C33  100nF  C-EUC0603  [C0603]
C34  100n  C-EUC0603  [C0603]
C36  100n  CC0603  [C0603]
F1  0R  RR1206  [R1206]
F2  0R  RR1206  [R1206]
IC8  LM1117MPX-3.3  [SOT223]
IC11  STM32F722RET6  [QFP50P1200X1200X160-64N]
JAM  JUMPER-2PTH  [1X02]
JP2  JP3Q  [JP3Q]
PA9BOOT  PABOOT  JP2E  [JP2]
POWR  JUMPER-2PTH  [1X02]
PWR  LED  LEDSML0805  [SML0805]
R2  100K  R-EU_M0805  [M0805]
R3  10k  R-EU_R0603  [R0603]
U$5  USB-A-2_USB_USB-A-2  [USB-A-2_USB_USB-A-2]
UART  JUMPER-2PTH  [1X02]
X2  SMD-CRYSTAL-25MHZ-20PF-20PPM(2P-5.0X3.2MM)  SMD-CRYSTAL-8MHZ-20PF-20PPM(2P-5.0X3.2MM)  [X2-SMD-5.0X3.2X1.3MM]

### Nets
!BACK1: IC11.52(PC11) ; also sheet 1
!FWD1: IC11.2(PC13) ; also sheet 1
!LEFT1: IC11.51(PC10) ; also sheet 1
!OUT1: IC11.37(PC6) ; also sheet 1
!P1_TRG1: IC11.4(PC15-OSC32_OUT) ; also sheet 1
!P1_TRG2: IC11.3(PC14-OSC32_IN) ; also sheet 1
!RIGHT1: IC11.38(PC7) ; also sheet 1
ARM_SND: IC11.20(PA4) ; also sheet 1
ARMD0: IC11.25(PB0) ; also sheet 1
ARMD1: IC11.26(PB1) ; also sheet 1
ARMD2: IC11.27(PB2) ; also sheet 1
ARMD3: IC11.55(PB3(JTDO/TRACESWO)) ; also sheet 1
ARMD4: IC11.56(PB4(!JTRST)) ; also sheet 1
ARMD5: IC11.57(PB5) ; also sheet 1
ARMD6: IC11.58(PB6) ; also sheet 1
ARMD7: IC11.59(PB7) ; also sheet 1
ARMINT: IC11.8(PC0) ; also sheet 1
BOOT: BOOT0.2 IC11.60(BOOT)
BTN3: IC11.50(PA15(JTDI)) JAM.1
BTN4: IC11.43(PA10) JAM.2
GND: BOOT0.1 C1.2 C2.2 C3.2 C4.2 C5.2 C6.2 C7.2 C8.2 C9.2 C10.2 C11.2 C12.2 C13.2 C14.2 C16.2 C22.2 C28.2 C29.2 C30.2 C31.2 C32.2 C33.2 C34.2 C36.2 IC8.1(GND) IC11.12(VSSA) IC11.18(VSS) IC11.31(VSS) IC11.47(VSS) IC11.63(VSS) JP2.2 PA9BOOT.1 POWR.2 PWR.C U$5.1-4(-A:1-4) U$5.2-4(-B:2-4) U$5.SHIELD1(SHIELD:SHIELD1) U$5.SHIELD2(SHIELD:SHIELD2) U$5.SHIELD3(SHIELD:SHIELD3) U$5.SHIELD4(SHIELD:SHIELD4) ; also sheet 1
INTSIG4: IC11.21(PA5) ; also sheet 1
INTSIG5: IC11.22(PA6) ; also sheet 1
INTSIG6: IC11.23(PA7) ; also sheet 1
INTSIG7: IC11.24(PC4) ; also sheet 1
INTSIG16: IC11.28(PB10) ; also sheet 1
INTSIG17: IC11.29(PB11) ; also sheet 1
INTSIG18: IC11.61(PB8) ; also sheet 1
INTSIG19: IC11.62(PB9) ; also sheet 1
INTSIG20: IC11.11(PC3) ; also sheet 1
INTSIG21: IC11.10(PC2) ; also sheet 1
INTSIG22: IC11.9(PC1) ; also sheet 1
LED: IC11.34(PB13) ; also sheet 1
MSXPORTC0: IC11.14(PA0-WKUP) ; also sheet 1
MSXPORTC1: IC11.15(PA1) ; also sheet 1
MSXPORTC2: IC11.16(PA2) ; also sheet 1
MSXPORTC3: IC11.17(PA3) ; also sheet 1
N$18: PWR.A R3.2
N$20: F1.2 U$5.2-1(-B:2-1)
N$21: F2.2 U$5.1-1(-A:1-1)
NRST: C7.1 IC11.7(!RST) JP2.4 R2.1
OSCIN: C10.1 IC11.5(PH0-OSC_IN) X2.2
OSCOUT: C11.1 IC11.6(PH1-OSC_OUT) X2.1
PA9BOOT: IC11.42(PA9) PA9BOOT.2
SW1: IC11.39(PC8) ; also sheet 1
SW2: IC11.40(PC9) ; also sheet 1
SWCLK: IC11.49(PA14(JTCK-SWCLK)) JP2.5
SWDIO: IC11.46(PA13(JTMS-SWDIO)) JP2.6
UART5_RX: IC11.54(PD2) UART.1
UART5_TX: IC11.53(PC12) UART.2
USB1_DM: IC11.44(PA11) U$5.2-2(-B:2-2)
USB1_DP: IC11.45(PA12) U$5.2-3(-B:2-3)
USB2_DM: IC11.35(PB14) U$5.1-2(-A:1-2)
USB2_DP: IC11.36(PB15) U$5.1-3(-A:1-3)
VCAP: C22.1 IC11.30(VCAP_1)
VCC: C1.1 C3.1 F1.1 F2.1 IC8.3(IN) JP2.1 PA9BOOT.3 POWR.1 ; also sheet 1
VCC3.3V: BOOT0.3 C2.1 C4.1 C5.1 C6.1 C8.1 C9.1 C12.1 C13.1 C14.1 C16.1 C28.1 C29.1 C30.1 C31.1 C32.1 C33.1 C34.1 C36.1 IC8.2(OUT) IC8.TAB(OUT1) IC11.1(VBAT) IC11.13(VREF+) IC11.19(VDD) IC11.32(VDD) IC11.48(VDD) IC11.64(VDD) JP2.3 R2.2 R3.1 ; supply symbol labelled VDD ; also sheet 1
Unconnected: IC11.33(PB12) IC11.41(PA8)

### Buses
A[0..15],AD[0..7],ARMD[0..7],ARM_D[0..7],ARMINT,ARM_SND,AUD_O,!BACK[1..2],BDIR,B_O,BOOT,BTN[3..4],BUSAK,BUS_INT,BUSRQ,CAS[0..3],CD[0..7],CLK28M,CLKCPU,CLKCPU_CLEAN,CLKCPU_RAW,D[0..7],!EXCS[1..2],!EXCS12,!EXSLTSL[1..2],!FWD[1..2],GND,G_O,HALT,!INT,INTSIG[0..7],INTSIG[0..23],IORQ,LED,!LEFT[1..2],LSE_OSCIN,LSE_OSCOUT,!M1,MREQ,MSXPORTB[0..7],MSXPORTC[0..7],NMI,NRST,O_AUD,OSCIN,OSCOUT,!OUT[1..2],!P1_TRG[1..2],!P2_TRG[1..2],PA9BOOT,PPI_SND,PSGA[0..7],PSG_AUD,PSGB[0..7],PSG_CHAN[1..3],PSGCLK,RAMSLOT[0..4],RAS,RD,RD[0..7],!RESET,!RFSH,!RIGHT[1..2],R_O,ROMA[14..18],ROMCE,ROMOE,!RW_VRAM,SA[0..13],SCC_AUD,!SCE,SD[0..7],SJ[1..4],SLOTCLK,!SLOT_INT,SND_IN[1..2],SOUND_IN,SPI2_CK,SPI2_MISO,SPI2_MOSI,SPI2_NSS,SW[1..2],SWCLK,SWDIO,SWR,TCK,TDI,TDO,TMS,_TXD,UART4_RX,UART4_TX,UART5_RX,UART5_TX,USB1_DM,USB1_DP,USB2_DM,USB2_DP,VBAT,VCAP,VCC,VCC2.5V,VCC3.3V,VCC-12V,VCC12V,VDD,!VDP_INT,!VDPR,VDPSEL,!VDPW,VGND,VID_CSYNC,VID_GND,VID_HSYNC,VID_SYNC,!VRESET,VSS,WAIT,WR,YMA8,!YMA9,YMBC[1..2],YMBDIR,YMSEL

### Notes on the sheet
- Debug Console

## Power pins joined to a net without a drawn wire
GND: IC15.8(GND) IC16.8(GND) IC17.7(P:GND)
VCC: IC15.16(VCC) IC16.16(VCC) IC17.14(P:VCC)

## Library data of the parts
AUD JAM POWR UART = SparkFun-Retired:JUMPER-2: Jumper Basic 0.1" spaced jumper. Use with breakaway headers.
BOOT0 JP4 PA9BOOT = jumper:JP2E: JUMPER
C1 C6 C12 C13 C15 C17-C23 C25-C27 C30 C33-C35 C37-C44 C48-C50 C53-C63 = rcl:C-EU: CAPACITOR, European symbol; SPICEPREFIX: C
C2-C5 C7-C11 C14 C16 C28 C29 C31 C32 C36 = eagle-ltspice:C: CAPACITOR, European symbol; SPICEMODEL: NONE; SPICEPREFIX: C
C24 C45-C47 = SamacSys_Parts:EEEHA1C100R: Panasonic Aluminium Electrolytic Capacitor 10uF 16V dc 4mm B HA SMD Series, Surface Mount Electrolytic, +/-20% Source: Datasheet <http://uk.rs-online.com/web/p/products/7472796P>; DESCRIPTION: Panasonic Aluminium Electrolytic Capacitor 10uF 16V dc 4mm B HA SMD Series, Surface Mount Electrolytic, +/-20%; HEIGHT: 5.5mm; MANUFACTURER_NAME: Panasonic; MANUFACTURER_PART_NUMBER: EEEHA1C100R; RS_PART_NUMBER: 7472796P; RS_PRICE-STOCK: http://uk.rs-online.com/web/p/products/7472796P
C51 C52 = resistor:C-EU: CAPACITOR, European symbol
CN1 CN2 = SamacSys_Parts:5530843-5: Standard Card Edge Connectors 100 VRT 50DP Source: Datasheet <https://www.te.com/commerce/DocumentDelivery/DDEController?Action=srchrtrv&DocNm=5530843&DocType=Customer Drawing&DocLang=English&PartCntxt=5530843-5&DocFormat=pdf>; DESCRIPTION: Standard Card Edge Connectors 100 VRT 50DP; HEIGHT: 15.494mm; MANUFACTURER_NAME: TE Connectivity; MANUFACTURER_PART_NUMBER: 5530843-5; MOUSER_PART_NUMBER: 571-5530843-5; MOUSER_PRICE-STOCK: https://www.mouser.co.uk/ProductDetail/TE-Connectivity/5530843-5?qs=4hg9R9g9MDs2Hy6WGw1quQ%3D%3D
F1 F2 = eagle-ltspice:R: RESISTOR, European symbol; SPICEMODEL: NONE; SPICEPREFIX: R
IC1 = zilog:Z80CPU: Z80 FAMILY DEVICE
IC2-IC5 = memories:41464: DRAM 64K x 4 bits
IC6 = SamacSys_Parts:AS7C4096A-12TCN: SRAM 4M, 5V, 12ns, FAST 512K x 8 Asynch SRAM Source: Datasheet <https://componentsearchengine.com/Datasheets/1/AS7C4096A-12TCN.pdf>; DESCRIPTION: SRAM 4M, 5V, 12ns, FAST 512K x 8 Asynch SRAM; HEIGHT: 1.2mm; MANUFACTURER_NAME: Alliance Memory; MANUFACTURER_PART_NUMBER: AS7C4096A-12TCN; MOUSER_PART_NUMBER: 913-AS7C4096A-12TCN; MOUSER_PRICE-STOCK: https://www.mouser.com/Search/Refine.aspx?Keyword=913-AS7C4096A-12TCN
IC7 = SamacSys_Parts:AT27C020-55JU: AT27C020-55JU, OTP EPROM Memory 2Mbit 256K x 8 bit 55ns, 5.0V 32-Pin PLCC Source: Datasheet
IC8 = lm1117:LM1117MPX-*
IC9 = tfmsx:VDP9958
IC10 = sjl540:SAMACSYS_PARTS_XC95144XL-10TQG144I: XC95144XL-10TQG144I XC95144XL-10TQG144I, CPLD XC9500XL Flash 144 Cells, 117 I/O, 8 Labs, ISP, 3 3.6 V 144-Pin TQFP <https://componentsearchengine.com/Images/3/XC95144XL-10TQG144I.jpg> Source: Datasheet <http://docs-europe.electrocomponents.com/webdocs/0c77/0900766b80c77f42.pdf>; DESCRIPTION: XC95144XL-10TQG144I XC95144XL-10TQG144I, CPLD XC9500XL Flash 144 Cells, 117 I/O, 8 Labs, ISP, 3 3.6 V 144-Pin TQFP; HEIGHT: 1.6mm; MANUFACTURER_NAME: XILINX; MANUFACTURER_PART_NUMBER: XC95144XL-10TQG144I; RS_PART_NUMBER: 6260624; SUPPLIER_NAME: RS
IC11 = STM32F722RET6:STM32F722RET6: STM32F Series 512 KB Flash 256 kB RAM 216 MHz 32-Bit Microcontroller - LQFP-64; AVAILABILITY: Unavailable; DESCRIPTION: ARM® Cortex®-M7 STM32F7 Microcontroller IC 32-Bit 216MHz 512KB _512K x 8_ FLASH 64-LQFP _10x10_; MF: STMicroelectronics; MP: STM32F722RET6; PACKAGE: LQFP-64 STMicroelectronics; PRICE: None
IC12 = MCP6002T-I_SN:MCP6002T-I_SN: Op. Amplifier Dual 1MHz Low-Power SOIC8 Microchip MCP6002T-I/SN, Dual Low Power Op Amp, 1MHz Rail-Rail, 1.8 6 V, 8-Pin SOIC Source: Datasheet <http://uk.rs-online.com/web/p/products/8234276P>; ALLIED_NUMBER: 70451327; DESCRIPTION: Op. Amplifier Dual 1MHz Low-Power SOIC8 Microchip MCP6002T-I/SN, Dual Low Power Op Amp, 1MHz Rail-Rail, 1.8 6 V, 8-Pin SOIC; HEIGHT: 1.75mm; MANUFACTURER_NAME: Microchip; MANUFACTURER_PART_NUMBER: MCP6002T-I/SN; RS_PART_NUMBER: 8234276P; RS_PRICE-STOCK: http://uk.rs-online.com/web/p/products/8234276P
IC13 = YM2149:YM2149
IC14 = 74xx-little-de:74*1G17: Single Schmitt-Trigger Buffer
IC15 IC16 = 74xx-eu:74*157: Quadruple 2-line to 1-line data SELECTOR/MULTIPLEXER
IC17 = 74xx-eu:74*07: Hex BUFFER, open collector high-voltage output
J1 = con-jack:DCJ0202: DC POWER JACK Source: DCJ0202.pdf; OC_FARNELL: unknown; OC_NEWARK: unknown
JP2 = jumper:JP3Q: JUMPER
JP3 = jumper:JP1E: JUMPER
JP5 JP6 = microbuilder:HEADER-1X8: PIN HEADER
JTAG1 VIDEO = microbuilder:HEADER-1X6: PIN HEADER
L1-L14 R1-R19 R21 R22 = rcl:R-EU_: RESISTOR, European symbol; SPICEPREFIX: R
OSC2 = microbuilder:OSCILLATOR: Oscillators 3.2x2.5mm SMT 4.0MHz +/- 50ppm, 3.3V, 9mA, -40/+85°C - Digikey: 535-9752-1-ND 50MHz +/- 50ppm, 3.3V, 8mA, -10/+70°C - Digikey: 478-4792-1-ND 5x7mm SMT 4.0MHz +/-20ppm 3.3V, 20mA, -20/+70°C - Digikey: 535-9329-2-ND 50MHz +/- 25ppm 3.3V, 35mA, -40/+85°C - Digikey: 631-1197-1-ND
PWR USB = led:LED: LED OSRAM: - CHIPLED LG R971, LG N971, LY N971, LG Q971, LY Q971, LO R971, LY R971 LH N974, LH R974 LS Q976, LO Q976, LY Q976 LO Q996 - Hyper CHIPLED LW Q18S LB Q993, LB Q99A, LB R99A - SideLED LS A670, LO A670, LY A670, LG A670, LP A670 LB A673, LV A673, LT A673, LW A673 LH A674 LY A675 LS A676, LA A676, LO A676, LY A676, LW A676 LS A679, LY A679, LG A679 - Hyper Micro SIDELED® LS Y876, LA Y876, LO Y876, LY Y876 LT Y87S - SmartLED LW L88C, LW L88S LB L89C, LB L89S, LG L890 LS L89K, LO L89K, LY L89K LS L896, LA L896, LO L896, LY L896 - TOPLED LS T670, LO T670, LY T670, LG T670, LP T670 LSG T670, LSP T670, LSY T670, LOP T670, LYG T670 LG T671, LOG T671, LSG T671 LB T673, LV T673, LT T673, LW T673 LH T674 LS T676, LA T676, LO T676, LY T676, LB T676, LH T676, LSB T676, LW T676 LB T67C, LV T67C, LT T67C, LS T67K, LO T67K, LY T67K, LW E67C LS E67B, LA E67B, LO E67B, LY E67B, LB E67C, LV E67C, LT E67C LW T67C LS T679, LY T679, LG T679 LS T770, LO T770, LY T770, LG T770, LP T770 LB T773, LV T773, LT T773, LW T773 LH T774 LS E675, LA E675, LY E675, LS T675 LS T776, LA T776, LO T776, LY T776, LB T776 LHGB T686 LT T68C, LB T68C - Hyper Mini TOPLED® LB M676 - Mini TOPLED Santana® LG M470 LS M47K, LO M47K, LY M47K Source: http://www.osram.convergy.de LUXEON: - LUMILED® LXK2-PW12-R00, LXK2-PW12-S00, LXK2-PW14-U00, LXK2-PW14-V00 LXK2-PM12-R00, LXK2-PM12-S00, LXK2-PM14-U00 LXK2-PE12-Q00, LXK2-PE12-R00, LXK2-PE12-S00, LXK2-PE14-T00, LXK2-PE14-U00 LXK2-PB12-K00, LXK2-PB12-L00, LXK2-PB12-M00, LXK2-PB14-N00, LXK2-PB14-P00, LXK2-PB14-Q00 LXK2-PR12-L00, LXK2-PR12-M00, LXK2-PR14-Q00, LXK2-PR14-R00 LXK2-PD12-Q00, LXK2-PD12-R00, LXK2-PD12-S00 LXK2-PH12-R00, LXK2-PH12-S00 LXK2-PL12-P00, LXK2-PL12-Q00, LXK2-PL12-R00 Source: www.luxeon.com KINGBRIGHT: KA-3528ASYC Source: www.kingbright.com
Q1 = crystal:CRYSTAL: CRYSTAL; OC_FARNELL: 1667008; OC_NEWARK: unknown
RN1-RN11 = tf4060:CAY16-103J4LF: Res Thick Film Array 10K Ohm 5% 200ppm/C ISOL Molded 8-Pin 1206(4 X 0603) Convex SMD Paper T/R; AVAILABILITY: Good; DESCRIPTION: Res Thick Film Array 10K Ohm 5% ?200ppm/C ISOL Molded 8-Pin 1206(4 X 0603) Convex SMD Paper T/R; MF: Bourns; MP: CAY16-103J4LF; PACKAGE: 1206 Bourns; PRICE: 0.02 USD
S1 S2 = switch-dil:219-02*: Surface Mount DIP Switch Series 219 SMT CTS Electronic Components Sourc: www.ctscorp.com; OC_FARNELL: unknown; OC_NEWARK: unknown
TP3 = testpad:TP: Test pad
U$3 = tfmsx:DIN45326
U$5 = board:USB-A-2_USB_USB-A-2: Reichelt USB AW-2 http://www.reichelt.de/USB-FireWire-Verbinder/USB-AW-2/index.html?;ACTION=3;LA=444;GROUP=C1C;GROUPID=5208;ARTICLE=52004;START=0;SORT=id;OFFSET=100;SID=11TVAtpH8AAAIAAFKOLUob7739b188f91ab8cc657b33b81a56c4a
X1 X3 = con-subd:F09: SUB-D; OC_FARNELL: unknown; OC_NEWARK: unknown
X2 = SMD-CRYSTAL-8MHZ-20PF-20PPM_2P-5.0X3.2MM_:SMD-CRYSTAL-8MHZ-20PF-20PPM(2P-5.0X3.2MM): 306010004; AVAILABILITY: Unavailable; DESCRIPTION: SMD Crystal 8MHz-20pF-20ppm;; MF: Xinhunjing; MP: 5032/4P; PACKAGE: None; PRICE: None

## Net classes
0 default: width 0.152 mm, drill 0.3 mm, clearance 0.152 mm